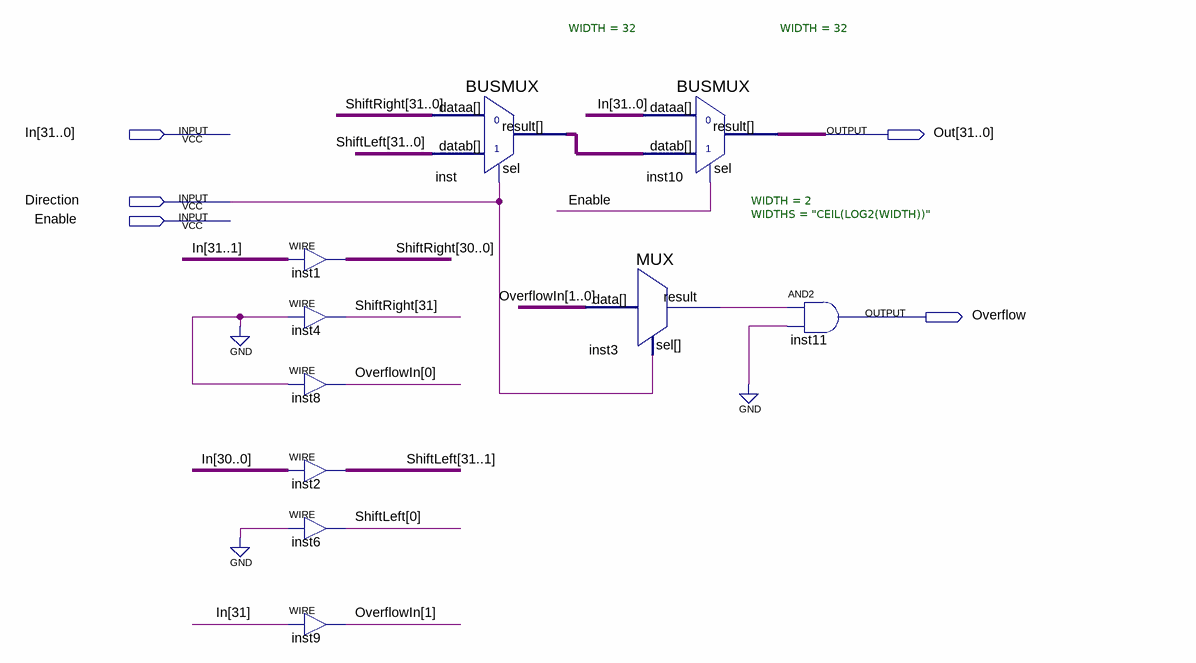
[diagram p0: schematic sheet]
// Quartus schematic Shift1.bdf as structural Verilog: 10 symbols, 5 pins
module Shift1 (
  input  [31:0] In,
  input  Direction,
  input  Enable,
  output [31:0] Out,
  output Overflow
);

  wire inst3_result;
  wire [1:0] OverflowIn;
  wire [31:0] inst_result, ShiftLeft, ShiftRight;

  assign ShiftRight[30:0] = In[31:1];  // WIRE inst1
  assign ShiftRight[31] = 1'b0;  // WIRE inst4
  assign OverflowIn[0] = 1'b0;  // WIRE inst8
  assign ShiftLeft[31:1] = In[30:0];  // WIRE inst2
  assign ShiftLeft[0] = 1'b0;  // WIRE inst6
  assign OverflowIn[1] = In[31];  // WIRE inst9
  BUSMUX #(.WIDTH(32)) inst (.datab(ShiftLeft), .sel(Direction), .dataa(ShiftRight), .result(inst_result));
  MUX #(.WIDTH(2), .WIDTHS("CEIL(LOG2(WIDTH))")) inst3 (.data(OverflowIn), .sel(Direction), .result(inst3_result));
  BUSMUX #(.WIDTH(32)) inst10 (.datab(inst_result), .sel(Enable), .dataa(In), .result(Out));
  and inst11 (Overflow, inst3_result, 1'b0);
endmodule
